# Altium schematic sheet HE Mixer.SchDoc
size A; SheetNumber: 7; SheetTotal: 12
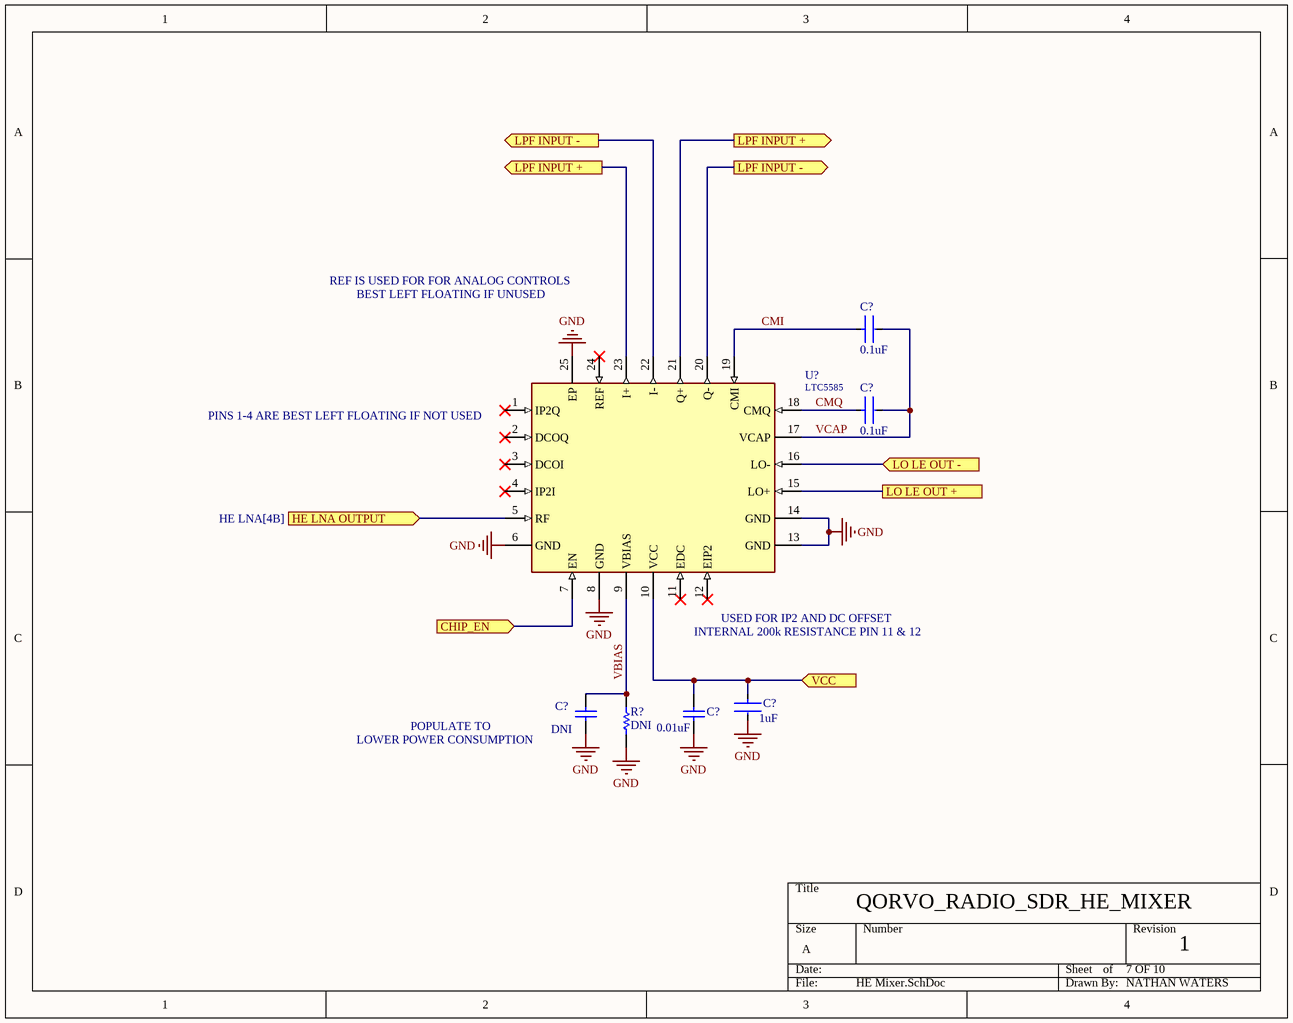
[diagram p0: HE Mixer.SchDoc]

## Parts
(Parts that share a designator on the sheet are numbered #1, #2 ... from top to bottom, then left to right.)
C?#1  Capacitance: 0.1uF  [FP-GRM155-0_05-MFG]  (hidden comment: GRM155R71C104KA88J)
C?#2  Capacitance: 0.1uF  [FP-GRM155-0_05-MFG]  (hidden comment: GRM155R71C104KA88J)
C?#3  Capacitance: 0.01uF  [CAPC1005X55X25LL05T10]  (hidden comment: GRM155R71C103KA01D)
C?#4  CAPACITANCE: 1uF  [FP-GRM155-0_1-MFG]  (hidden comment: GRM155R61H105KE05D)
C?#5  value DNI  (hidden comment: Capacitor)
R?  value DNI  (hidden comment: Resistor)
U?  LTC5585  [QFN50P400X400X80-25N-D]

## Ports
CHIP_EN (in, see LE Mixer[2C], LO[1B]), HE LNA OUTPUT (in, see HE LNA[4B]), LO LE OUT + (see LE Mixer[3B], LO[1C]), LO LE OUT - (in, see LE Mixer[3B], LO[1D]), LPF INPUT + (out, see HE Mixer[2A], LE Mixer[2A], LE Mixer[3A], LPF[1B]), LPF INPUT + (out, see HE Mixer[3A], LE Mixer[2A], LE Mixer[3A], LPF[1B]), LPF INPUT - (out, see HE Mixer[2A], LE Mixer[2A], LE Mixer[3A], LPF[1C]), LPF INPUT - (out, see HE Mixer[3A], LE Mixer[2A], LE Mixer[3A], LPF[1C]), VCC (in, see HE LNA[3A], LE LNA[3A], LE Mixer[3C], LPF[1B], SWITCH[3B])

## Nets
GND: C?#3.2 C?#4.2 C?#5.1 R?.1 U?.6(GND) U?.8(GND) U?.13(GND) U?.14(GND) U?.25(EP)
CHIP_EN: U?.7(EN) ; port CHIP_EN
CMI: C?#1.1 U?.19(CMI)
CMQ: C?#2.1 U?.18(CMQ)
HE LNA OUTPUT: U?.5(RF) ; port HE LNA OUTPUT
LO LE OUT +: U?.15(LO+) ; port LO LE OUT +
LO LE OUT -: U?.16(LO-) ; port LO LE OUT -
LPF INPUT +: U?.21(Q+) U?.23(I+) ; port LPF INPUT +
LPF INPUT -: U?.20(Q-) U?.22(I-) ; port LPF INPUT -
VBIAS: C?#5.2 R?.2 U?.9(VBIAS)
VCAP: C?#1.2 C?#2.2 U?.17(VCAP)
VCC: C?#3.1 C?#4.1 U?.10(VCC) ; port VCC

Not connected (* = marked no-connect by the designer): U? 1(IP2Q)* 2(DCOQ)* 3(DCOI)* 4(IP2I)* 11(EDC)* 12(EIP2)* 24(REF)*

## Notes on the sheet
- REF IS USED FOR FOR ANALOG CONTROLS
- BEST LEFT FLOATING IF UNUSED
- PINS 1-4 ARE BEST LEFT FLOATING IF NOT USED
- INTERNAL 200k RESISTANCE PIN 11 & 12
- (near U?) USED FOR IP2 AND DC OFFSET
- LOWER POWER CONSUMPTION
- POPULATE TO
- QORVO_RADIO_SDR_HE_MIXER
- 7 OF 10
- 1
- NATHAN WATERS

## Library data of the parts
C?#1 C?#2 = CMP-2008-03928-2: NexarPartId: 9223238; Manufacturer Lifecycle Status: NRND; Voltage: 16V; Tolerance: 10%; Dielectric: X7R; Material: Ceramic; Schedule B: 8532240020, 8532240020; Mount: Surface Mount; Case/Package: 0402; Case Code (Imperial): 0402; Min Operating Temperature: -55°C; Length: 1mm; Voltage Rating (DC): 16V; Depth: 500µm; Lead Free: Lead Free; Max Operating Temperature: 125°C; Case Code (Metric): 1005; Radiation Hardening: No; Height: 550µm; Voltage Rating: 16V; Packaging: Cut Tape; RoHS: Compliant; Width: 500µm; Number of Pins: 2; REACH SVHC: No SVHC; Termination: SMD/SMT; Thickness: 500µm
C?#3 = CMP-2000-06332-1: Chip Capacitor, 10 nF, 16 V, 10%, -55 to 125 degC, 0402 (1005 Metric), RoHS, Tape and Reel; Manufacturer: Murata; Rated Voltage: 16V; Dielectric: X7R; Manufacturer URL: http://www.murata.com/; Package Description: 2-Pin Surface Mount Device, Body 1 x 0.5 mm; Case Size/Dimension: 0402; Tolerance (%): ±10%; Datasheet Version: 06/2016; Package Reference: 0402; Mounting Technology: SurfaceMount; Datasheet URL: http://psearch.en.murata.com/capacitor/product/GRM155R71C103KA01%23.pdf
C?#4 = CMP-06035-026840-2: CERAMIC CAP, MLCC 1UF 50VDC X5R
C?#5 = Capacitor: SimulationGenericComponent: True
R? = Resistor: TC1: 0; SimulationGenericComponent: True; TC2: 0
U? = LTC5585IUF#PBF: HE MIXER; Manufacturer_Name: Analog Devices; Manufacturer_Part_Number: LTC5585IUF#PBF; Datasheet Link: https://www.analog.com/media/en/technical-documentation/data-sheets/5585fb.pdf